# EAGLE schematic Modulo ISD Voicer (EAGLE 4.09)
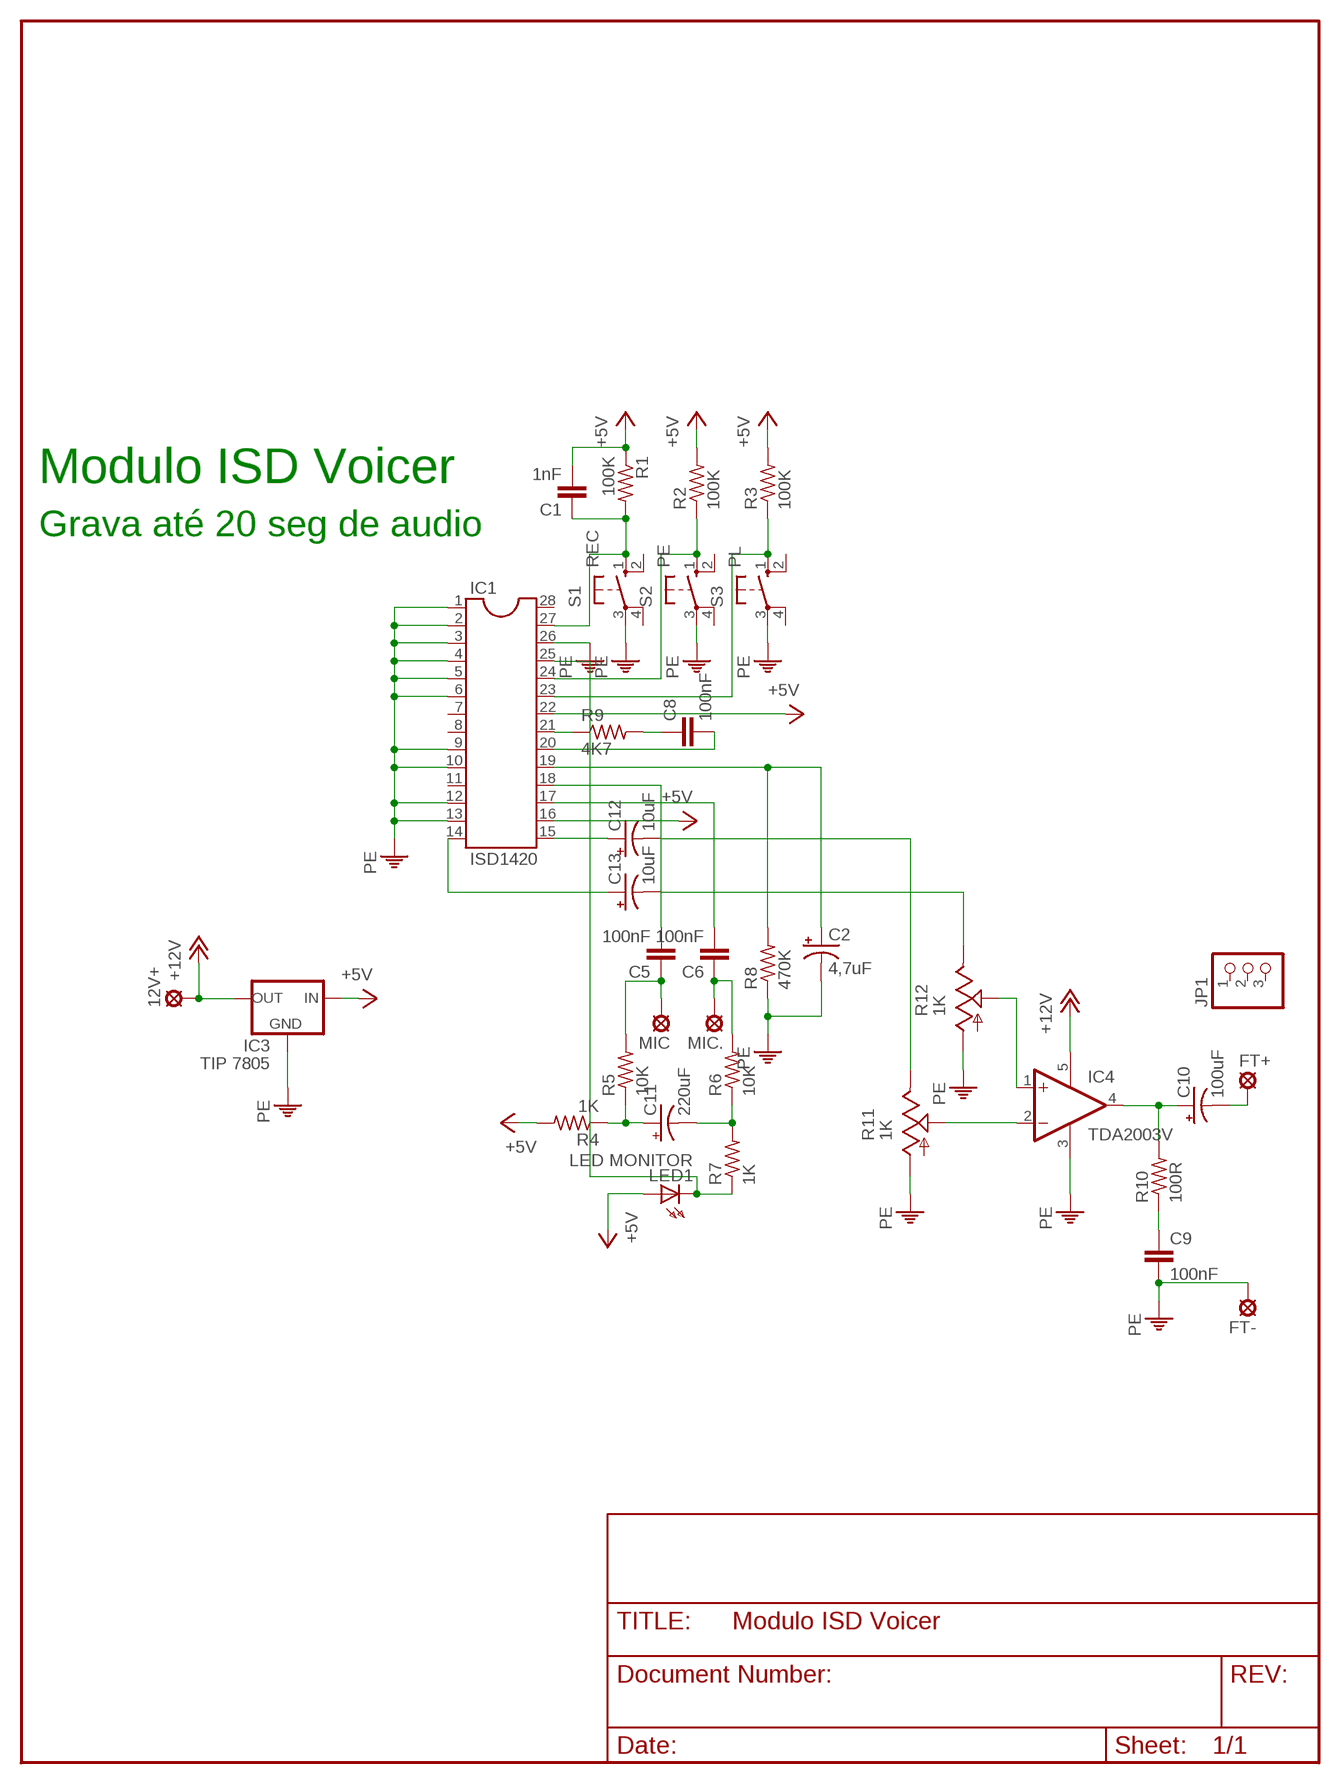
[diagram p0: schematic, sheet 1]

## Parts
12V+  SE14  [SE14]
C1  1nF  C-EU050-025X075  [C050-025X075]
C2  4,7uF  CPOL-USE2.5-6  [E2,5-6]
C5  100nF  C-EU050-025X075  [C050-025X075]
C6  100nF  C-EU050-025X075  [C050-025X075]
C8  100nF  C-EU050-025X075  [C050-025X075]
C9  100nF  C-EU050-025X075  [C050-025X075]
C10  100uF  CPOL-USE3.5-8  [E3,5-8]
C11  220uF  CPOL-USE3.5-8  [E3,5-8]
C12  10uF  CPOL-USE2.5-6  [E2,5-6]
C13  10uF  CPOL-USE2.5-6  [E2,5-6]
FT+  SE14  [SE14]
FT-  SE14  [SE14]
IC1  ISD1420  DIL28  [DIL28-6]
IC3  TIP 7805  78XXS  [78XXS]
IC4  TDA2003V  [CB360]
JP1  PINHD-1X3  [1X03]
LED1  LED MONITOR  LED5MM  [LED5MM]
MIC  SE14  [SE14]
MIC.  SE14  [SE14]
R1  100K  R-US_0207/10  [0207/10]
R2  100K  R-US_0207/10  [0207/10]
R3  100K  R-US_0207/10  [0207/10]
R4  1K  R-US_0207/10  [0207/10]
R5  10K  R-US_0207/10  [0207/10]
R6  10K  R-US_0207/10  [0207/10]
R7  1K  R-US_0207/10  [0207/10]
R8  470K  R-US_0207/10  [0207/10]
R9  4K7  R-US_0207/10  [0207/10]
R10  100R  R-US_0207/10  [0207/10]
R11  1K  TRIM_US-ST15  [ST15]
R12  1K  TRIM_US-ST15  [ST15]
S1  REC  10-XX  [B3F-10XX]
S2  PE  10-XX  [B3F-10XX]
S3  PL  10-XX  [B3F-10XX]

## Nets
56: C6.1 MIC..MP R6.2
+5V: C1.2 IC1.16 IC1.22 IC3.IN LED1.A R1.1 R2.2 R3.2 R4.2
+12V: 12V+.MP IC3.OUT IC4.5(V+)
N$1: C12.- R11.E
N$2: C1.1 IC1.27 R1.2 S1.1(S)
N$3: IC1.24 R2.1 S2.1(S)
N$4: IC1.23 R3.1 S3.1(S)
N$5: C13.+ IC1.14
N$6: C12.+ IC1.15
N$7: C13.- R12.E
N$8: C10.+ IC4.4(OUT) R10.2
N$9: C2.+ IC1.19 R8.2
N$10: C9.1 R10.1
N$11: IC1.21 R9.1
N$12: C8.1 R9.2
N$13: C10.- FT+.MP
N$14: IC4.2(-IN) R11.S
N$15: IC4.1(+IN) R12.S
N$16: C8.2 IC1.20
N$30: C5.2 IC1.18
N$31: C6.2 IC1.17
N$34: C11.- R6.1 R7.2
N$35: IC1.25 LED1.K(C) R7.1
N$38: C11.+ R4.1 R5.1
N$39: C5.1 MIC.MP R5.2
PE: C2.- C9.2 FT-.MP IC1.1 IC1.2 IC1.3 IC1.4 IC1.5 IC1.6 IC1.9 IC1.10 IC1.12 IC1.13 IC1.26 IC3.GND IC4.3(GND) R8.1 R11.A R12.A S1.3(P) S2.3(P) S3.3(P)
Unconnected: IC1.7 IC1.8 IC1.11 IC1.28 JP1.1 JP1.2 JP1.3 S1.2(S1) S1.4(P1) S2.2(S1) S2.4(P1) S3.2(S1) S3.4(P1)

## Notes on the sheet
- Modulo ISD Voicer
- Grava até 20 seg de audio

## Library data of the parts
12V+ FT+ FT- MIC MIC. = solpad:SE14: SOLDER PAD E1553, drill 1,4mm, distributor Buerklin, 07F820
C1 C5 C6 C8 C9 = rcl:C-EU: CAPACITOR, European symbol
C2 C10-C13 = rcl:CPOL-US: POLARIZED CAPACITOR, American symbol
IC1 = dil:DIL28: SOCKET Dual In Line
IC3 = v-reg:78XXS: VOLTAGE REGULATOR
IC4 = linear:TDA2003: AUDIO AMPLIFIER
JP1 = pinhead:PINHD-1X3: PIN HEADER
LED1 = led:LED: LED
R1-R10 = rcl:R-US_: RESISTOR, American symbol
R11 R12 = pot:TRIM_US-: POTENTIOMETER
S1-S3 = switch-omron:10-XX: OMRON SWITCH